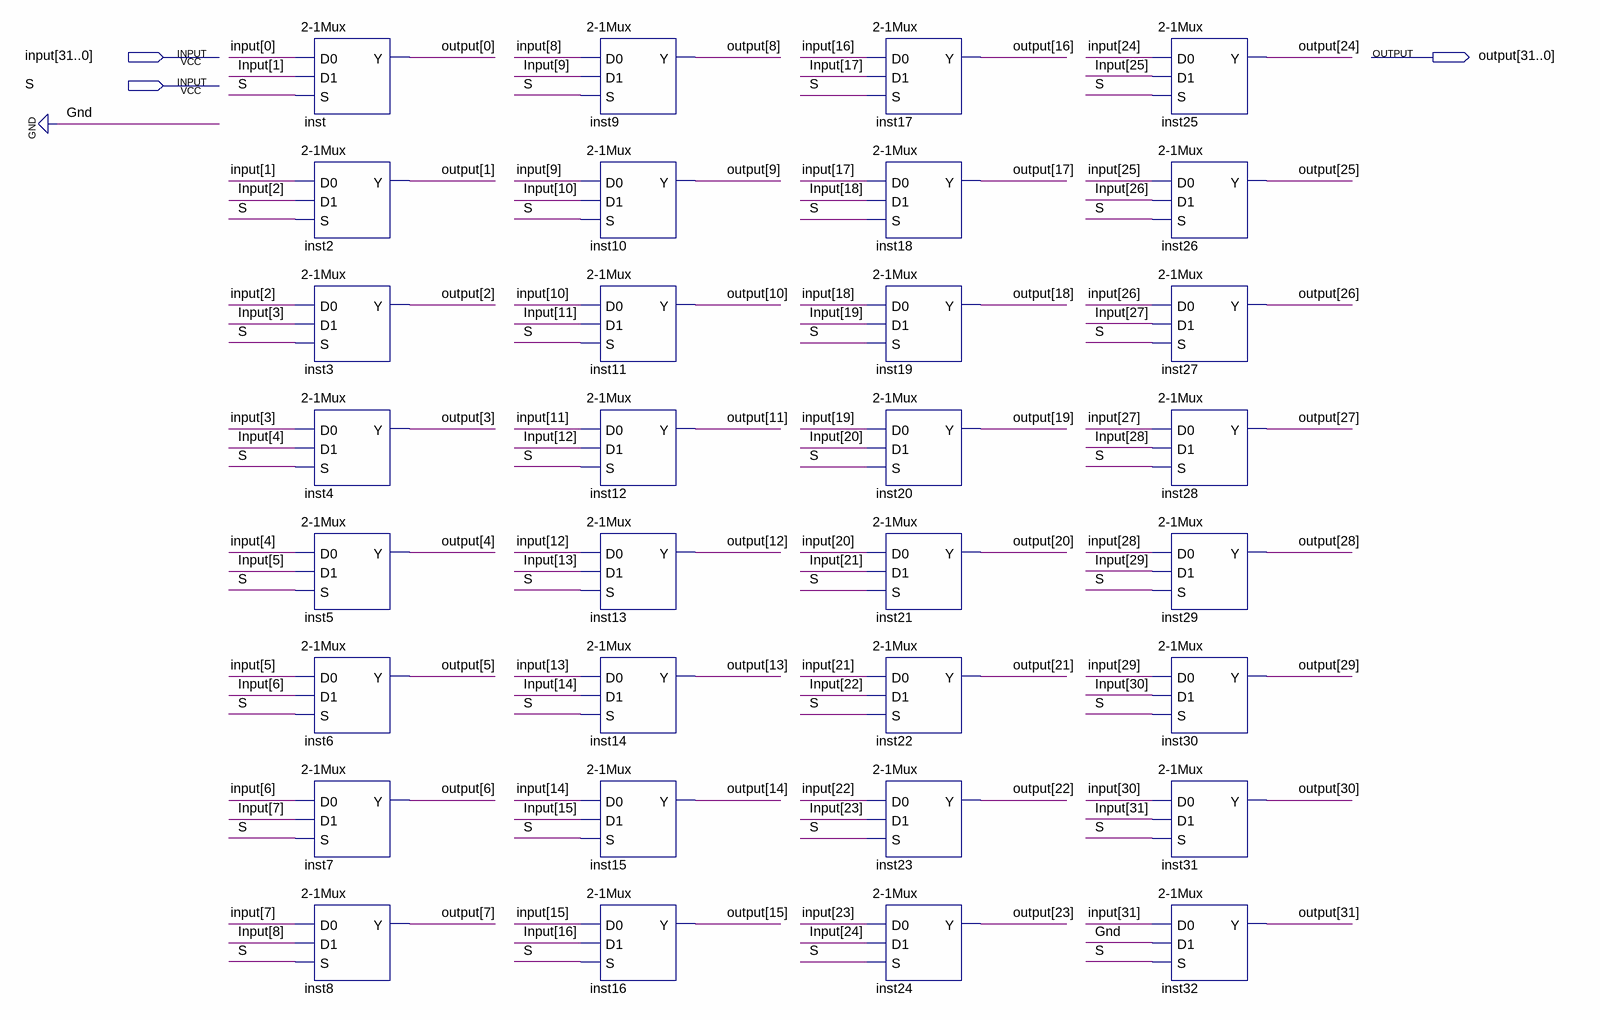
[diagram p0: schematic sheet]
// Quartus schematic RightShifter1.bdf as structural Verilog: 32 symbols, 3 pins
module RightShifter1 (
  input  [31:0] \input ,
  input  S,
  output [31:0] \output 
);

  \2-1Mux  inst (.D0(\input [0]), .D1(\input [1]), .S(S), .Y(\output [0]));
  \2-1Mux  inst2 (.D0(\input [1]), .D1(\input [2]), .S(S), .Y(\output [1]));
  \2-1Mux  inst3 (.D0(\input [2]), .D1(\input [3]), .S(S), .Y(\output [2]));
  \2-1Mux  inst4 (.D0(\input [3]), .D1(\input [4]), .S(S), .Y(\output [3]));
  \2-1Mux  inst5 (.D0(\input [4]), .D1(\input [5]), .S(S), .Y(\output [4]));
  \2-1Mux  inst6 (.D0(\input [5]), .D1(\input [6]), .S(S), .Y(\output [5]));
  \2-1Mux  inst7 (.D0(\input [6]), .D1(\input [7]), .S(S), .Y(\output [6]));
  \2-1Mux  inst8 (.D0(\input [7]), .D1(\input [8]), .S(S), .Y(\output [7]));
  \2-1Mux  inst9 (.D0(\input [8]), .D1(\input [9]), .S(S), .Y(\output [8]));
  \2-1Mux  inst10 (.D0(\input [9]), .D1(\input [10]), .S(S), .Y(\output [9]));
  \2-1Mux  inst11 (.D0(\input [10]), .D1(\input [11]), .S(S), .Y(\output [10]));
  \2-1Mux  inst12 (.D0(\input [11]), .D1(\input [12]), .S(S), .Y(\output [11]));
  \2-1Mux  inst13 (.D0(\input [12]), .D1(\input [13]), .S(S), .Y(\output [12]));
  \2-1Mux  inst14 (.D0(\input [13]), .D1(\input [14]), .S(S), .Y(\output [13]));
  \2-1Mux  inst15 (.D0(\input [14]), .D1(\input [15]), .S(S), .Y(\output [14]));
  \2-1Mux  inst16 (.D0(\input [15]), .D1(\input [16]), .S(S), .Y(\output [15]));
  \2-1Mux  inst17 (.D0(\input [16]), .D1(\input [17]), .S(S), .Y(\output [16]));
  \2-1Mux  inst18 (.D0(\input [17]), .D1(\input [18]), .S(S), .Y(\output [17]));
  \2-1Mux  inst19 (.D0(\input [18]), .D1(\input [19]), .S(S), .Y(\output [18]));
  \2-1Mux  inst20 (.D0(\input [19]), .D1(\input [20]), .S(S), .Y(\output [19]));
  \2-1Mux  inst21 (.D0(\input [20]), .D1(\input [21]), .S(S), .Y(\output [20]));
  \2-1Mux  inst22 (.D0(\input [21]), .D1(\input [22]), .S(S), .Y(\output [21]));
  \2-1Mux  inst23 (.D0(\input [22]), .D1(\input [23]), .S(S), .Y(\output [22]));
  \2-1Mux  inst24 (.D0(\input [23]), .D1(\input [24]), .S(S), .Y(\output [23]));
  \2-1Mux  inst25 (.D0(\input [24]), .D1(\input [25]), .S(S), .Y(\output [24]));
  \2-1Mux  inst26 (.D0(\input [25]), .D1(\input [26]), .S(S), .Y(\output [25]));
  \2-1Mux  inst27 (.D0(\input [26]), .D1(\input [27]), .S(S), .Y(\output [26]));
  \2-1Mux  inst28 (.D0(\input [27]), .D1(\input [28]), .S(S), .Y(\output [27]));
  \2-1Mux  inst29 (.D0(\input [28]), .D1(\input [29]), .S(S), .Y(\output [28]));
  \2-1Mux  inst30 (.D0(\input [29]), .D1(\input [30]), .S(S), .Y(\output [29]));
  \2-1Mux  inst31 (.D0(\input [30]), .D1(\input [31]), .S(S), .Y(\output [30]));
  \2-1Mux  inst32 (.D0(\input [31]), .D1(1'b0), .S(S), .Y(\output [31]));
endmodule
